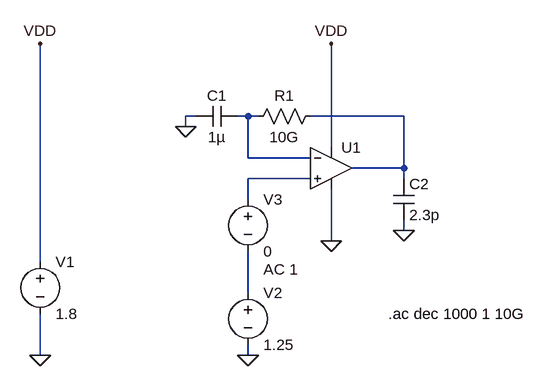
[diagram p0: schematic ac_ideal.asc]
ac_ideal.asc, the LTspice schematic file:
Version 4
SHEET 1 880 680
WIRE -32 96 -48 96
WIRE 48 96 32 96
WIRE 64 96 48 96
WIRE 288 96 144 96
WIRE -48 112 -48 96
WIRE 176 144 176 -16
WIRE 48 160 48 96
WIRE 144 160 48 160
WIRE 288 176 288 96
WIRE 288 176 208 176
WIRE 144 192 48 192
WIRE 288 192 288 176
WIRE 48 224 48 192
WIRE 288 272 288 256
WIRE 176 288 176 208
WIRE -272 320 -272 -16
WIRE 48 368 48 304
WIRE -272 464 -272 400
WIRE 48 464 48 448
FLAG -48 112 0
FLAG -272 464 0
FLAG 176 288 0
FLAG -272 -16 VDD
FLAG 176 -16 VDD
FLAG 48 464 0
FLAG 288 272 0
SYMBOL OpAmps\\UniversalOpAmp 176 176 R0
SYMATTR InstName U1
SYMATTR Value2 Avol=2500 GBW=25Meg Vos=0
SYMBOL res 160 80 R90
WINDOW 0 0 56 VBottom 2
WINDOW 3 32 56 VTop 2
SYMATTR InstName R1
SYMATTR Value 10G
SYMBOL cap 32 80 R90
WINDOW 0 0 32 VBottom 2
WINDOW 3 32 32 VTop 2
SYMATTR InstName C1
SYMATTR Value 1µ
SYMBOL voltage -272 304 R0
WINDOW 123 0 0 Left 0
WINDOW 39 0 0 Left 0
SYMATTR InstName V1
SYMATTR Value 1.8
SYMBOL voltage 48 352 R0
WINDOW 123 0 0 Left 0
WINDOW 39 0 0 Left 0
SYMATTR InstName V2
SYMATTR Value 1.25
SYMBOL voltage 48 208 R0
WINDOW 123 24 124 Left 2
WINDOW 39 0 0 Left 0
SYMATTR InstName V3
SYMATTR Value 0
SYMATTR Value2 AC 1
SYMBOL cap 272 192 R0
SYMATTR InstName C2
SYMATTR Value 2.3p
TEXT 264 400 Left 2 !.ac dec 1000 1 10G

The netlist it stands for:
* ac_ideal.asc
XU1 N003 N001 VDD 0 N002 level1 Avol=2500 GBW=25Meg Vos=0 En=0 Enk=0 In=0 Ink=0 Rin=500Meg  ; pins In+ In- V+ V- OUT
R1 N002 N001 10G
C1 N001 0 1µ
V1 VDD 0 1.8
V2 N004 0 1.25
V3 N003 N004 0 AC 1
C2 N002 0 2.3p
.ac dec 1000 1 10G
.lib UniversalOpAmp1.lib
.backanno
.end